# Altium project Light Control - 8-16 in 16-32 out MainBlock.PrjPcb
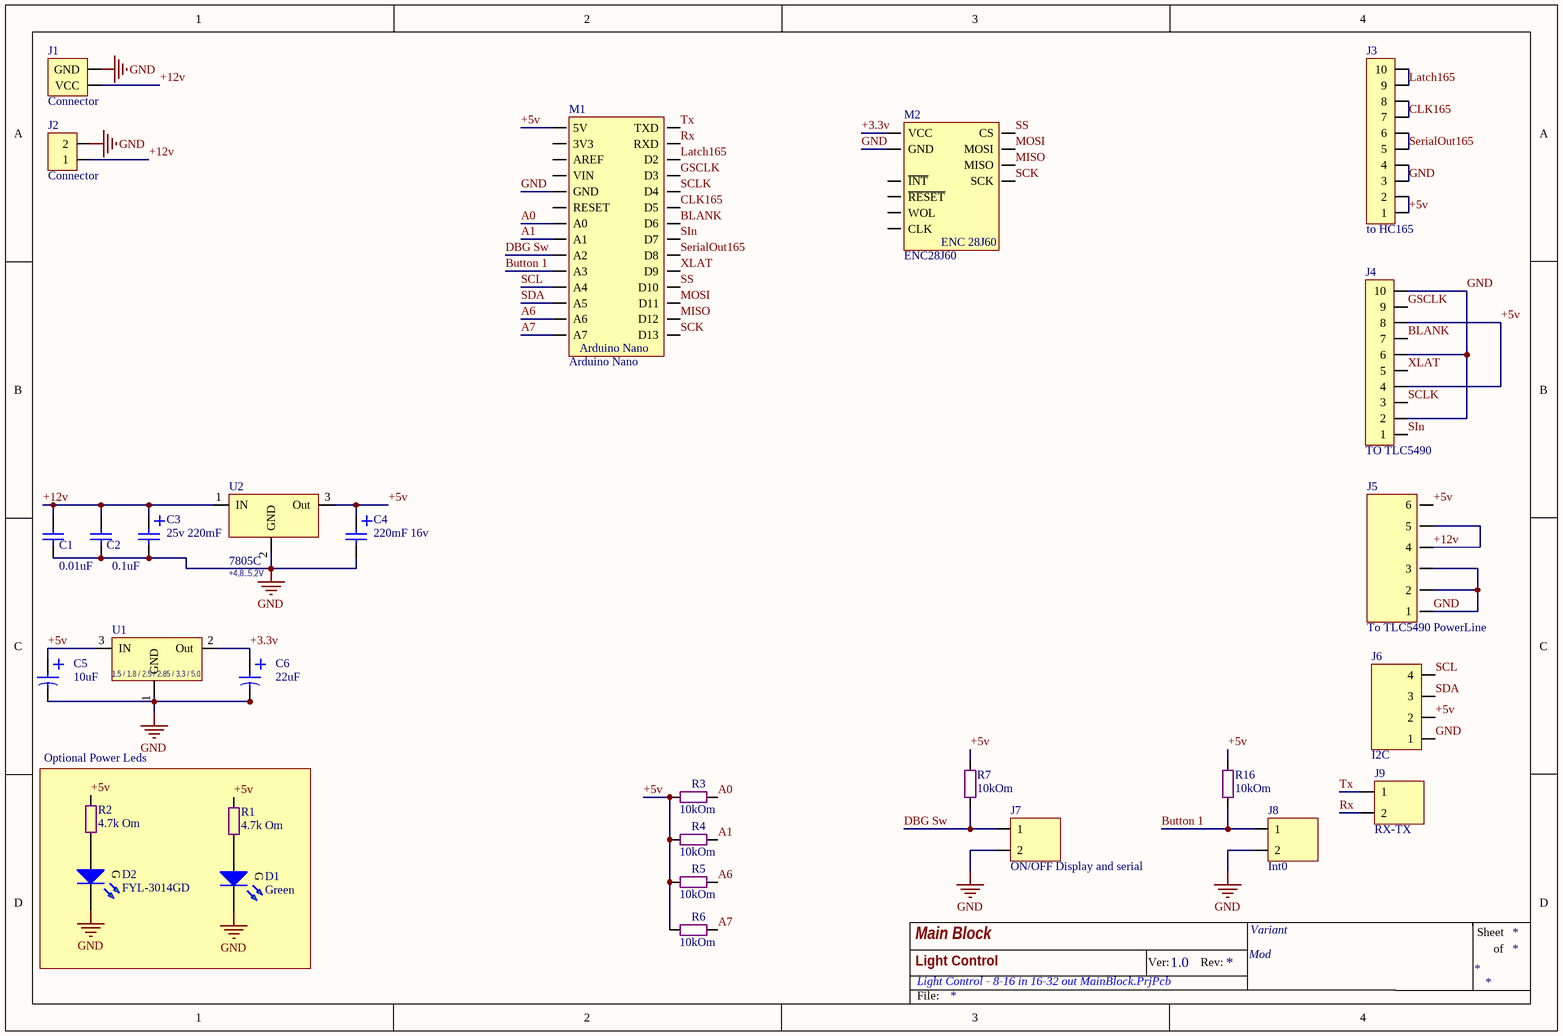
[diagram p0: Light Control - 8-16 in 16-32 out MainBlock.SchDoc]
1 sheet, 29 parts. Net scope: global (net labels, ports and power ports of the same name join across sheets).
Board file: Light Control - 8-16 in 16-32 out MainBlock.PcbDoc

## Sheet Light Control - 8-16 in 16-32 out MainBlock.SchDoc: Main Block
size A4; Version: 1.0; Variant: Variant; Modification: Mod; Project: Light Control; PageSetup: Record=PageOptions|CenterHorizontal=True|CenterVertical=True|PrintScale=0.97|XCorrection=1.00|YCorrection=1.00|PrintKind=1|BorderSize=5000000|LeftOffset=0|BottomOffset=0|Orientation=2|PaperLength=2970|PaperWidth=2100|Scale=100|PaperSource=7|PrintQuality=-4|MediaType=1|DitherType=10|PaperKind=A4|PrintScaleMode=1

### Parts
C1  0.01uF  [SMD 0805 (2012)]
C2  0.1uF  [SMD 0805 (2012)]
C3  25v 220mF  [Cap E p2mm D6.5xH11]
C4  220mF 16v  [Cap E p2mm D6.5xH11]
C5  10uF  [SMD 1206 Tantal (3216)]
C6  22uF  [SMD 3528 Tantal (1210)]
D1  Green  [LED SMD 0805 Green]
D2  FYL-3014GD  [LED Round 3mm Green]
J1  Connector  [DC Connector]
J2  Connector  [DG301 5mm 2p]
J3  to HC165  [LINE 2.54 x 10D (2 x 5) - BH]
J4  TO TLC5490  [LINE 2.54 x 10D (2 x 5) - BH]
J5  To TLC5490 PowerLine  [Molex Mini-Fit Jr - 6Pin R]
J6  I2C  [Line 2.54 X 4]
J7  ON/OFF Display and serial  [Line 2.54 x 2]
J8  Int0  [Line 2.54 x 2]
J9  RX-TX  [Line 2.54 x 2]
M1  Arduino Nano  [Arduino Nano]
M2  ENC28J60  [ENC28J60 MiNi]
R1  4.7k Om  [SMD 0805 (2012)]
R2  4.7k Om  [SMD 0805 (2012)]
R3  10kOm  [SMD 0805 (2012)]
R4  10kOm  [SMD 0805 (2012)]
R5  10kOm  [SMD 0805 (2012)]
R6  10kOm  [SMD 0805 (2012)]
R7  10kOm  [SMD 0805 (2012)]
R16  10kOm  [SMD 0805 (2012)]
U1  V Out: 1.5 / 1.8 / 2.5 / 2.85 / 3.3 / 5.0  [SOT-223-3 (AMS)]  (hidden comment: AMS1117 1.5 / 1.8 / 2.5 / 2.85 / 3.3 / 5.0)
U2  7805C  V Out: +4,8..5,2V  [D-PAK]

### Blocks framed on the sheet
Optional Power Leds: D1 D2 R1 R2

### Nets
GND: C1.2 C2.2 C3.2 C4.2 C5.GND C6.GND D1.K D2.K J1.GND J2.2 J3.3 J3.4 J4.2 J4.6 J4.10 J5.1 J5.2 J5.3 J6.1 J7.2 J8.2 M1.GND M2.GND U1.1(GND) U2.2(GND)
+3.3v: C6.VCC M2.VCC U1.2(Out)
+5v: C4.1 C5.VCC J3.1 J3.2 J4.4 J4.8 J5.6 J6.2 M1.5V R1.1 R2.1 R3.2 R4.2 R5.2 R6.2 R7.2 R16.2 U1.3(IN) U2.3(Out)
+12v: C1.1 C2.1 C3.1 J1.VCC J2.1 J5.4 J5.5 U2.1(IN)
A0: M1.A0 R3.1
A1: M1.A1 R4.1
A6: M1.A6 R5.1
A7: M1.A7 R6.1
BLANK: J4.7 M1.D6
Button 1: J8.1 M1.A3 R16.1
CLK165: J3.7 J3.8 M1.D5
DBG Sw: J7.1 M1.A2 R7.1
GSCLK: J4.9 M1.D3
Latch165: J3.9 J3.10 M1.D2
MISO: M1.D12 M2.MISO
MOSI: M1.D11 M2.MOSI
Rx: J9.2 M1.RXD
SCK: M1.D13 M2.SCK
SCL: J6.4 M1.A4
SCLK: J4.3 M1.D4
SDA: J6.3 M1.A5
SerialOut165: J3.5 J3.6 M1.D8
SIn: J4.1 M1.D7
SS: M1.D10 M2.CS
Tx: J9.1 M1.TXD
XLAT: J4.5 M1.D9
NetD1_A: D1.A R1.2
NetD2_A: D2.A R2.2

Not connected (* = marked no-connect by the designer): M1 3V3 AREF RESET VIN; M2 CLK INT(~{INT}) RESET(~{RESET}) WOL

### Notes on the sheet
- Ver:
- Rev:
- Sheet
- of
- File:
- (in symbol ENC28J60) ENC 28J60
- (in symbol Led Round 3mm Green) G
- (in symbol Led SMD Green) G

### Library data of the parts
C1 C2 = Cap SMD 0402-1812: Capacitor
C3 = Cap E 220mF x 16V: Capacitor; Value: 220mF 16v
C4 = Cap E 220mF x 16V: Capacitor; Value: 220mF 16v
C5 C6 = Cap Tantal: Capacitor
D1 = Led SMD Green: ?2v ?20mA; Forward Voltage TYP: ?2; Resistor for 5v VCC: 330 Om; Forward Voltage Min: ?; Wave len min/typ: ?; Liminous Min (mcd): ?; Liminous Typ (mcd): ?; Forward Amp (mA): ?; Color: Green
D2 = Led Round 3mm Green: 2.1v 10mA, 15-30mCd; Forward Voltage Max: 2.3; Forward Voltage TYP: 2.1; Wave len min/typ: 570nm; Liminous Typ (mcd): 15-30; Forward Amp (mA): 10; Color: Green; Name: FYL-3014GD
J1 = DC Connector (PJ-002B): DC Connector; Ext Pin Diameter: 5.5mm; Int Pin Diameter: 2.5
J2 = DG301-5.0-2P12: DG301 series
J3 J4 = PLD-10 (2 x 5): Vert, Dbl line, Male
J5 = Molex Mini-Fit Jr - 6 pin: Right, Dbl line, Female
J6 = PLS-4: Vert, Sgl line, Male
J7-J9 = PLS-2: Vert, Sgl line, Male
R1-R7 R16 = Res All Types
U1 = AMS1117_FIX: Voltage Regulator SOT-223-3; I output (A): 1; Max Voltage In (V): 15; t: -40...+125°C; Dropuot: 1-1.3V; Capacitors: In: 10mF; Out: 22mF; Case: SOT-223; Name: AMS1117 1.5 / 1.8 / 2.5 / 2.85 / 3.3 / 5.0; Dtatsheet: https://lib.chipdip.ru/029/DOC001029248.pdf
U2 = 7805C: Voltage Regulator; Manufacturer: Интеграл; I output (A): 1; Max Voltage In (V): 35; Напряжение выход-вход (dropout): >2V; t: -10..+70°C; Case: D2PAK; Shema: http://tec.org.ru/_bd/5/57349922.jpg; Name: 7805C
M2 = ENC28J60: ENC28J60 Chip Datasheet: http://lib.chipdip.ru/286/doc000286027.pdf